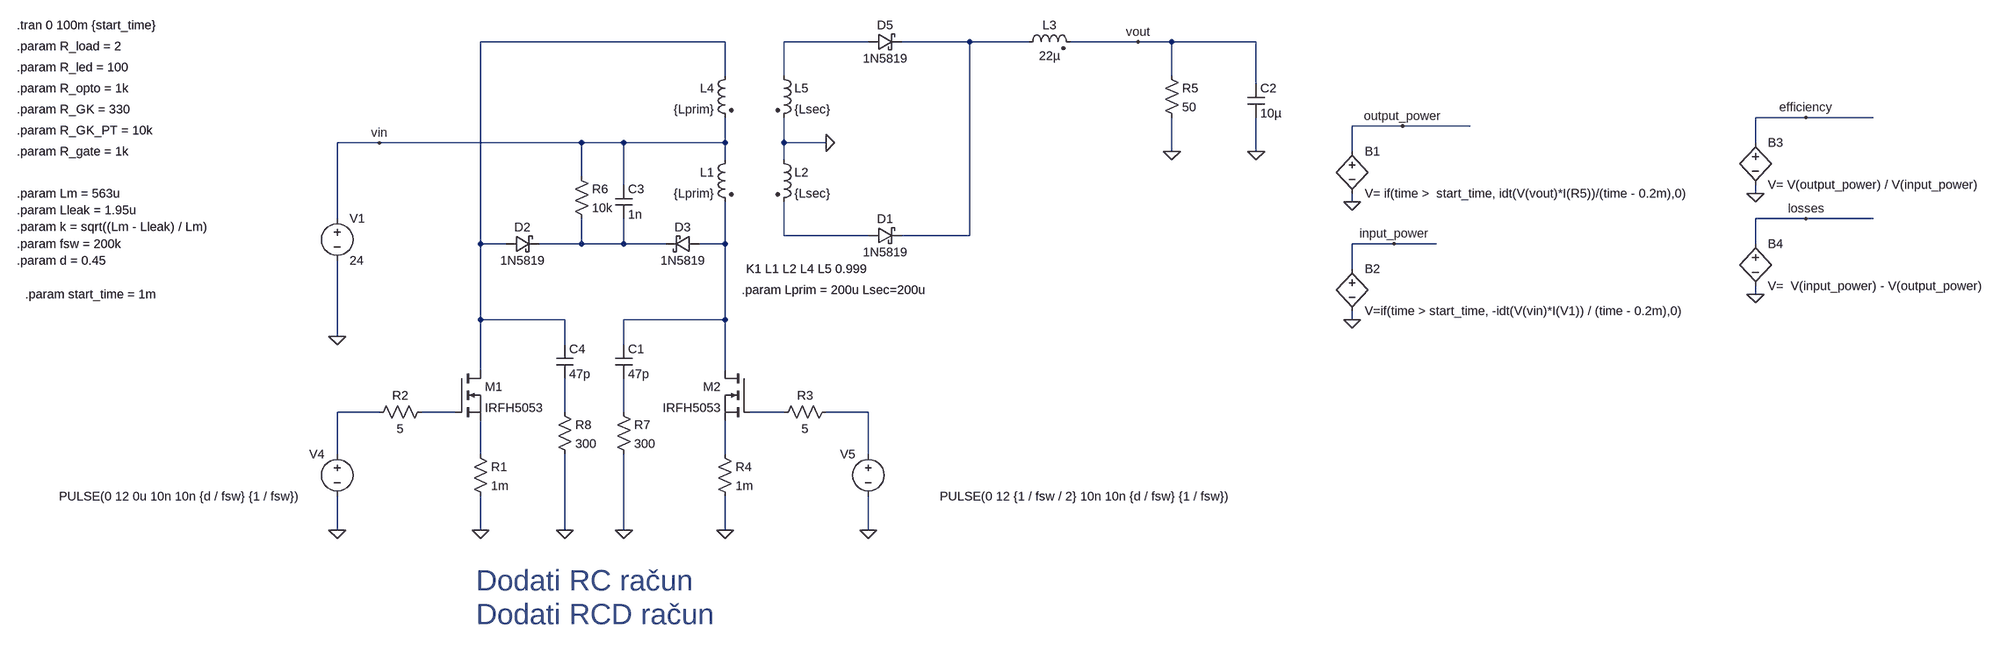
[diagram p0: schematic push_pull_converter.asc]
push_pull_converter.asc, the LTspice schematic file:
Version 4
SHEET 1 11460 3748
WIRE 1728 544 1264 544
WIRE 2000 544 1840 544
WIRE 2192 544 2064 544
WIRE 2304 544 2192 544
WIRE 2512 544 2384 544
WIRE 2576 544 2512 544
WIRE 2736 544 2576 544
WIRE 1728 608 1728 544
WIRE 1840 608 1840 544
WIRE 2576 608 2576 544
WIRE 2736 624 2736 544
WIRE 4048 688 3952 688
WIRE 4176 688 4048 688
WIRE 3184 704 3088 704
WIRE 3312 704 3184 704
WIRE 1072 736 992 736
WIRE 1456 736 1072 736
WIRE 1536 736 1456 736
WIRE 1728 736 1728 688
WIRE 1728 736 1536 736
WIRE 1840 736 1840 688
WIRE 1920 736 1840 736
WIRE 3952 736 3952 688
WIRE 2576 752 2576 688
WIRE 2736 752 2736 688
WIRE 3088 752 3088 704
WIRE 1728 768 1728 736
WIRE 1840 768 1840 736
WIRE 1456 800 1456 736
WIRE 1536 816 1536 736
WIRE 3952 832 3952 816
WIRE 3088 848 3088 832
WIRE 992 880 992 736
WIRE 4048 880 3952 880
WIRE 4176 880 4048 880
WIRE 1840 912 1840 848
WIRE 2000 912 1840 912
WIRE 2192 912 2192 544
WIRE 2192 912 2064 912
WIRE 1264 928 1264 544
WIRE 1312 928 1264 928
WIRE 1456 928 1456 880
WIRE 1456 928 1376 928
WIRE 1536 928 1536 880
WIRE 1536 928 1456 928
WIRE 1616 928 1536 928
WIRE 1728 928 1728 848
WIRE 1728 928 1680 928
WIRE 3168 928 3088 928
WIRE 3248 928 3168 928
WIRE 3952 928 3952 880
WIRE 3088 976 3088 928
WIRE 3952 1024 3952 1008
WIRE 1264 1072 1264 928
WIRE 1424 1072 1264 1072
WIRE 1728 1072 1728 928
WIRE 1728 1072 1536 1072
WIRE 3088 1072 3088 1056
WIRE 992 1104 992 960
WIRE 1424 1120 1424 1072
WIRE 1536 1120 1536 1072
WIRE 1264 1168 1264 1072
WIRE 1728 1168 1728 1072
WIRE 1072 1248 992 1248
WIRE 1216 1248 1152 1248
WIRE 1424 1248 1424 1184
WIRE 1536 1248 1536 1184
WIRE 1840 1248 1776 1248
WIRE 2000 1248 1920 1248
WIRE 992 1328 992 1248
WIRE 1264 1328 1264 1264
WIRE 1728 1328 1728 1264
WIRE 2000 1328 2000 1248
WIRE 992 1472 992 1408
WIRE 1264 1472 1264 1408
WIRE 1424 1472 1424 1328
WIRE 1536 1472 1536 1328
WIRE 1728 1472 1728 1408
WIRE 2000 1472 2000 1408
FLAG 1728 1472 0
FLAG 992 1104 0
FLAG 1264 1472 0
FLAG 2576 752 0
FLAG 1920 736 0
FLAG 2512 544 vout
FLAG 1072 736 vin
FLAG 3088 848 0
FLAG 3088 1072 0
FLAG 3184 704 output_power
FLAG 3168 928 input_power
FLAG 3952 832 0
FLAG 4048 688 efficiency
FLAG 3952 1024 0
FLAG 4048 880 losses
FLAG 992 1472 0
FLAG 2000 1472 0
FLAG 2736 752 0
FLAG 1536 1472 0
FLAG 1424 1472 0
SYMBOL voltage 992 864 R0
WINDOW 123 0 0 Left 0
WINDOW 39 0 0 Left 0
SYMATTR InstName V1
SYMATTR Value 24
SYMBOL res 1712 1312 R0
SYMATTR InstName R4
SYMATTR Value 1m
SYMBOL res 2560 592 R0
SYMATTR InstName R5
SYMATTR Value 50
SYMBOL cap 2720 624 R0
SYMATTR InstName C2
SYMATTR Value 10µ
SYMBOL ind2 2288 560 R270
WINDOW 0 32 56 VTop 2
WINDOW 3 5 56 VBottom 2
SYMATTR InstName L3
SYMATTR Value 22µ
SYMATTR Type ind
SYMBOL res 1248 1312 R0
SYMATTR InstName R1
SYMATTR Value 1m
SYMBOL res 1440 784 R0
SYMATTR InstName R6
SYMATTR Value 10k
SYMBOL cap 1520 816 R0
SYMATTR InstName C3
SYMATTR Value 1n
SYMBOL bv 3088 736 R0
SYMATTR InstName B1
SYMATTR Value V= if(time >  start_time, idt(V(vout)*I(R5))/(time - 0.2m),0)
SYMBOL bv 3088 960 R0
SYMATTR InstName B2
SYMATTR Value V=if(time > start_time, -idt(V(vin)*I(V1)) / (time - 0.2m),0)
SYMBOL bv 3952 720 R0
SYMATTR InstName B3
SYMATTR Value V= V(output_power) / V(input_power)
SYMBOL bv 3952 912 R0
SYMATTR InstName B4
SYMATTR Value V=  V(input_power) - V(output_power)
SYMBOL nmos 1216 1168 R0
SYMATTR InstName M1
SYMATTR Value IRFH5053
SYMBOL schottky 2000 560 R270
WINDOW 0 32 32 VTop 2
WINDOW 3 0 32 VBottom 2
SYMATTR InstName D5
SYMATTR Value 1N5819
SYMATTR Description Diode
SYMATTR Type diode
SYMBOL ind2 1744 752 M0
SYMATTR InstName L1
SYMATTR Value {Lprim}
SYMATTR Type ind
SYMBOL ind2 1824 752 R0
SYMATTR InstName L2
SYMATTR Value {Lsec}
SYMATTR Type ind
SYMBOL voltage 992 1312 M0
WINDOW 123 0 0 Left 0
WINDOW 39 0 0 Left 0
WINDOW 3 72 96 Left 2
SYMATTR Value PULSE(0 12 0u 10n 10n {d / fsw} {1 / fsw})
SYMATTR InstName V4
SYMBOL voltage 2000 1312 M0
WINDOW 123 0 0 Left 0
WINDOW 39 0 0 Left 0
WINDOW 3 -685 96 Left 2
SYMATTR Value PULSE(0 12 {1 / fsw / 2} 10n 10n {d / fsw} {1 / fsw})
SYMATTR InstName V5
SYMBOL res 1168 1232 R90
WINDOW 0 0 56 VBottom 2
WINDOW 3 32 56 VTop 2
SYMATTR InstName R2
SYMATTR Value 5
SYMBOL res 1936 1232 R90
WINDOW 0 0 56 VBottom 2
WINDOW 3 32 56 VTop 2
SYMATTR InstName R3
SYMATTR Value 5
SYMBOL nmos 1776 1168 M0
SYMATTR InstName M2
SYMATTR Value IRFH5053
SYMBOL ind2 1744 592 M0
SYMATTR InstName L4
SYMATTR Value {Lprim}
SYMATTR Type ind
SYMBOL ind2 1824 592 R0
SYMATTR InstName L5
SYMATTR Value {Lsec}
SYMATTR Type ind
SYMBOL schottky 2000 928 R270
WINDOW 0 32 32 VTop 2
WINDOW 3 0 32 VBottom 2
SYMATTR InstName D1
SYMATTR Value 1N5819
SYMATTR Description Diode
SYMATTR Type diode
SYMBOL schottky 1312 944 R270
WINDOW 0 32 32 VTop 2
WINDOW 3 0 32 VBottom 2
SYMATTR InstName D2
SYMATTR Value 1N5819
SYMATTR Description Diode
SYMATTR Type diode
SYMBOL schottky 1680 912 R90
WINDOW 0 0 32 VBottom 2
WINDOW 3 32 32 VTop 2
SYMATTR InstName D3
SYMATTR Value 1N5819
SYMATTR Description Diode
SYMATTR Type diode
SYMBOL cap 1520 1120 R0
SYMATTR InstName C1
SYMATTR Value 47p
SYMBOL res 1520 1232 R0
SYMATTR InstName R7
SYMATTR Value 300
SYMBOL cap 1408 1120 R0
SYMATTR InstName C4
SYMATTR Value 47p
SYMBOL res 1408 1232 R0
SYMATTR InstName R8
SYMATTR Value 300
TEXT 384 512 Left 2 !.tran 0 100m {start_time}
TEXT 384 592 Left 2 !.param R_led = 100
TEXT 384 632 Left 2 !.param R_opto = 1k
TEXT 384 552 Left 2 !.param R_load = 2
TEXT 384 672 Left 2 !.param R_GK = 330
TEXT 384 712 Left 2 !.param R_GK_PT = 10k
TEXT 384 752 Left 2 !.param R_gate = 1k
TEXT 384 864 Left 2 !.param Lleak = 1.95u
TEXT 384 896 Left 2 !.param k = sqrt((Lm - Lleak) / Lm)
TEXT 384 928 Left 2 !.param fsw = 200k
TEXT 384 960 Left 2 !.param d = 0.45
TEXT 384 832 Left 2 !.param Lm = 563u
TEXT 400 1024 Left 2 !.param start_time = 1m
TEXT 1768 976 Left 2 !K1 L1 L2 L4 L5 0.999
TEXT 1760 1016 Left 2 !.param Lprim = 200u Lsec=200u
TEXT 1256 1568 Left 5 ;Dodati RC račun
TEXT 1256 1632 Left 5 ;Dodati RCD račun

The netlist it stands for:
* push_pull_converter.asc
V1 vin 0 24
R4 N014 0 1m
R5 vout 0 50
C2 vout 0 10µ
L3 N003 vout 22µ
R1 N013 0 1m
R6 vin N005 10k
C3 vin N005 1n
B1 output_power 0 V= if(time >  start_time, idt(V(vout)*I(R5))/(time - 0.2m),0)
B2 input_power 0 V=if(time > start_time, -idt(V(vin)*I(V1)) / (time - 0.2m),0)
B3 efficiency 0 V= V(output_power) / V(input_power)
B4 losses 0 V=  V(input_power) - V(output_power)
M1 N001 N008 N013 N013 IRFH5053
D5 N002 N003 1N5819
L1 vin N006 {Lprim}
L2 0 N004 {Lsec}
V4 N007 0 PULSE(0 12 0u 10n 10n {d / fsw} {1 / fsw})
V5 N012 0 PULSE(0 12 {1 / fsw / 2} 10n 10n {d / fsw} {1 / fsw})
R2 N008 N007 5
R3 N012 N011 5
M2 N006 N011 N014 N014 IRFH5053
L4 N001 vin {Lprim}
L5 N002 0 {Lsec}
D1 N004 N003 1N5819
D2 N001 N005 1N5819
D3 N006 N005 1N5819
C1 N006 N010 47p
R7 N010 0 300
C4 N001 N009 47p
R8 N009 0 300
.model D D
.lib standard.dio
.model NMOS NMOS
.model PMOS PMOS
.lib standard.mos
.tran 0 100m {start_time}
.param R_led = 100
.param R_opto = 1k
.param R_load = 2
.param R_GK = 330
.param R_GK_PT = 10k
.param R_gate = 1k
.param Lleak = 1.95u
.param k = sqrt((Lm - Lleak) / Lm)
.param fsw = 200k
.param d = 0.45
.param Lm = 563u
.param start_time = 1m
K1 L1 L2 L4 L5 0.999
.param Lprim = 200u Lsec=200u
* Dodati RC račun
* Dodati RCD račun
.backanno
.end